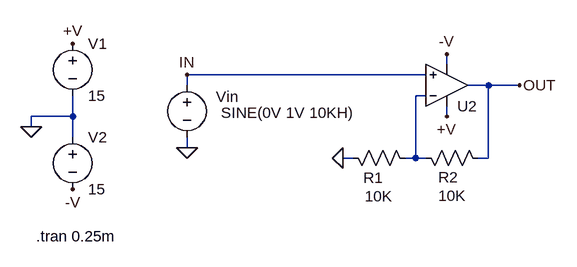
[diagram p0: schematic v1.0.asc]
v1.0.asc, the LTspice schematic file:
Version 4.1
SHEET 1 1240 700
WIRE 720 -1168 720 -1184
WIRE 688 -1152 320 -1152
WIRE 320 -1136 320 -1152
WIRE 784 -1136 752 -1136
WIRE 832 -1136 784 -1136
WIRE 688 -1120 672 -1120
WIRE 144 -1088 144 -1120
WIRE 144 -1088 80 -1088
WIRE 720 -1088 720 -1104
WIRE 80 -1072 80 -1088
WIRE 144 -1056 144 -1088
WIRE 320 -1040 320 -1056
WIRE 576 -1024 560 -1024
WIRE 672 -1024 672 -1120
WIRE 672 -1024 656 -1024
WIRE 688 -1024 672 -1024
WIRE 784 -1024 784 -1136
WIRE 784 -1024 768 -1024
FLAG 144 -1200 +V
FLAG 80 -1072 0
FLAG 320 -1040 0
FLAG 832 -1136 OUT
FLAG 320 -1152 IN
FLAG 720 -1088 +V
FLAG 144 -976 -V
FLAG 720 -1184 -V
FLAG 560 -1024 0
SYMBOL voltage 144 -1216 R0
WINDOW 123 0 0 Left 2
WINDOW 39 0 0 Left 2
SYMATTR InstName V1
SYMATTR Value 15
SYMBOL voltage 320 -1152 M0
WINDOW 123 24 146 Left 2
WINDOW 39 24 125 Left 2
WINDOW 0 -79 34 Left 2
WINDOW 3 -256 58 Left 2
SYMATTR InstName Vin
SYMATTR Value SINE(0V 1V 10KH)
SYMBOL res 672 -1008 M270
WINDOW 0 -30 65 VTop 2
WINDOW 3 -27 57 VBottom 2
SYMATTR InstName R1
SYMATTR Value 10K
SYMBOL res 784 -1008 M270
WINDOW 0 -29 62 VTop 2
WINDOW 3 -26 56 VBottom 2
SYMATTR InstName R2
SYMATTR Value 10K
SYMBOL voltage 144 -1072 R0
WINDOW 123 24 146 Left 2
WINDOW 39 24 125 Left 2
SYMATTR InstName V2
SYMATTR Value 15
SYMBOL OpAmps\\UniversalOpAmp 720 -1136 M180
SYMATTR InstName U2
TEXT 88 -904 Left 2 !.tran 0.25m

The netlist it stands for:
* v1.0.asc
V1 +V 0 15
Vin IN 0 SINE(0V 1V 10KH)
R1 N001 0 10K
R2 OUT N001 10K
V2 0 -V 15
X§U2 IN N001 +V -V OUT level1 Avol=1Meg GBW=10Meg Vos=0 En=0 Enk=0 In=0 Ink=0 Rin=500Meg  ; pins In+ In- V+ V- OUT
.tran 0.25m
.lib UniversalOpAmp1.lib
.backanno
.end